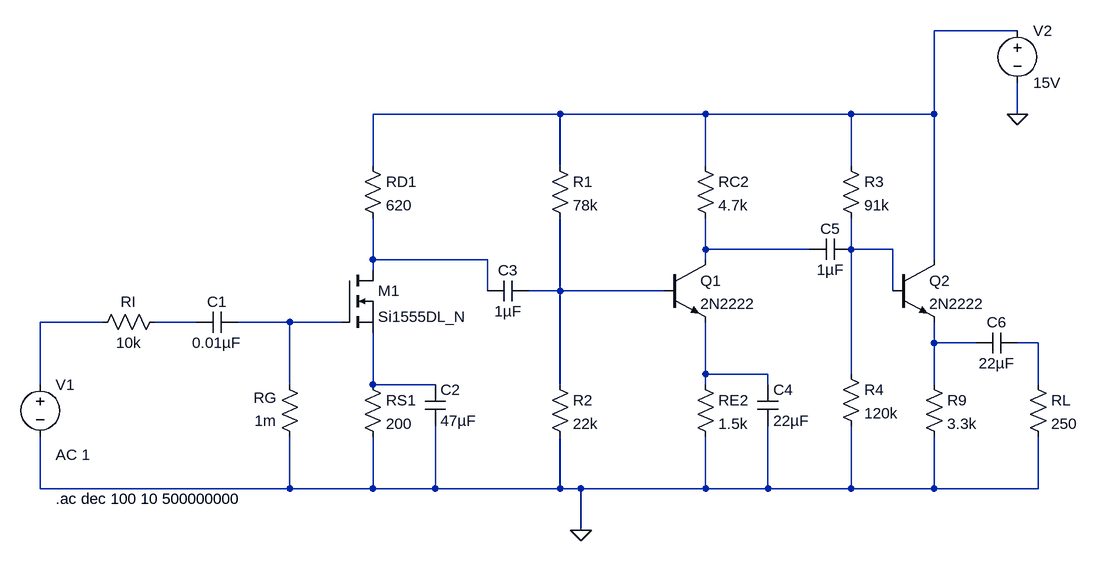
[diagram p0: schematic 3StageAmp.asc]
3StageAmp.asc, the LTspice schematic file:
Version 4
SHEET 1 880 680
WIRE 736 -160 608 -160
WIRE 32 -32 -256 -32
WIRE 256 -32 32 -32
WIRE 480 -32 256 -32
WIRE 608 -32 608 -160
WIRE 608 -32 480 -32
WIRE 736 -32 736 -80
WIRE -256 48 -256 -32
WIRE 32 48 32 -32
WIRE 256 48 256 -32
WIRE 480 48 480 -32
WIRE 256 176 256 128
WIRE 416 176 256 176
WIRE 480 176 480 128
WIRE 480 176 464 176
WIRE 544 176 480 176
WIRE -256 192 -256 128
WIRE -80 192 -256 192
WIRE 256 192 256 176
WIRE 608 192 608 -32
WIRE -256 208 -256 192
WIRE -80 240 -80 192
WIRE 32 240 32 128
WIRE 32 240 -16 240
WIRE 192 240 32 240
WIRE 544 240 544 176
WIRE -672 288 -768 288
WIRE -528 288 -592 288
WIRE -384 288 -464 288
WIRE -304 288 -384 288
WIRE 608 320 608 288
WIRE 672 320 608 320
WIRE 768 320 736 320
WIRE 256 368 256 288
WIRE 352 368 256 368
WIRE 480 368 480 176
WIRE -768 384 -768 288
WIRE -384 384 -384 288
WIRE -256 384 -256 304
WIRE -160 384 -256 384
WIRE 32 384 32 240
WIRE 256 384 256 368
WIRE 352 384 352 368
WIRE 608 384 608 320
WIRE 768 384 768 320
WIRE -768 544 -768 464
WIRE -384 544 -384 464
WIRE -384 544 -768 544
WIRE -256 544 -256 464
WIRE -256 544 -384 544
WIRE -160 544 -160 448
WIRE -160 544 -256 544
WIRE 32 544 32 464
WIRE 32 544 -160 544
WIRE 64 544 32 544
WIRE 256 544 256 464
WIRE 256 544 64 544
WIRE 352 544 352 448
WIRE 352 544 256 544
WIRE 480 544 480 448
WIRE 480 544 352 544
WIRE 608 544 608 464
WIRE 608 544 480 544
WIRE 768 544 768 464
WIRE 768 544 608 544
WIRE 64 608 64 544
FLAG 736 -32 0
FLAG 64 608 0
SYMBOL voltage -768 368 R0
WINDOW 123 24 124 Left 2
WINDOW 39 0 0 Left 0
SYMATTR InstName V1
SYMATTR Value ""
SYMATTR Value2 AC 1
SYMBOL res -576 272 R90
WINDOW 0 0 56 VBottom 2
WINDOW 3 32 56 VTop 2
SYMATTR InstName RI
SYMATTR Value 10k
SYMBOL res -368 480 R180
WINDOW 0 36 76 Left 2
WINDOW 3 36 40 Left 2
SYMATTR InstName RG
SYMATTR Value 1m
SYMBOL cap -464 272 R90
WINDOW 0 0 32 VBottom 2
WINDOW 3 32 32 VTop 2
SYMATTR InstName C1
SYMATTR Value 0.01µF
SYMBOL nmos -304 208 R0
SYMATTR InstName M1
SYMATTR Value Si1555DL_N
SYMBOL res -272 368 R0
SYMATTR InstName RS1
SYMATTR Value 200
SYMBOL cap -176 384 R0
SYMATTR InstName C2
SYMATTR Value 47µF
SYMBOL res -272 32 R0
SYMATTR InstName RD1
SYMATTR Value 620
SYMBOL res 16 32 R0
SYMATTR InstName R1
SYMATTR Value 78k
SYMBOL res 240 32 R0
SYMATTR InstName RC2
SYMATTR Value 4.7k
SYMBOL res 464 32 R0
SYMATTR InstName R3
SYMATTR Value 91k
SYMBOL cap -16 224 R90
WINDOW 0 0 32 VBottom 2
WINDOW 3 32 32 VTop 2
SYMATTR InstName C3
SYMATTR Value 1µF
SYMBOL npn 192 192 R0
SYMATTR InstName Q1
SYMATTR Value 2N2222
SYMBOL res 240 368 R0
SYMATTR InstName RE2
SYMATTR Value 1.5k
SYMBOL cap 336 384 R0
SYMATTR InstName C4
SYMATTR Value 22µF
SYMBOL cap 480 160 R90
WINDOW 0 0 32 VBottom 2
WINDOW 3 32 32 VTop 2
SYMATTR InstName C5
SYMATTR Value 1µF
SYMBOL npn 544 192 R0
SYMATTR InstName Q2
SYMATTR Value 2N2222
SYMBOL res 592 368 R0
SYMATTR InstName R9
SYMATTR Value 3.3k
SYMBOL cap 736 304 R90
WINDOW 0 0 32 VBottom 2
WINDOW 3 32 32 VTop 2
SYMATTR InstName C6
SYMATTR Value 22µF
SYMBOL res 752 368 R0
SYMATTR InstName RL
SYMATTR Value 250
SYMBOL voltage 736 -176 R0
WINDOW 123 0 0 Left 0
WINDOW 39 0 0 Left 0
SYMATTR InstName V2
SYMATTR Value 15V
SYMBOL res 16 368 R0
SYMATTR InstName R2
SYMATTR Value 22k
SYMBOL res 464 352 R0
SYMATTR InstName R4
SYMATTR Value 120k
TEXT -744 560 Left 2 !.ac dec 100 10 500000000

The netlist it stands for:
* 3StageAmp.asc
V1 N006 0 AC 1
RI N007 N006 10k
RG 0 N008 1m
C1 N008 N007 0.01µF
M1 N004 N008 N012 N012 Si1555DL_N
RS1 N012 0 200
C2 N012 0 47µF
RD1 N001 N004 620
R1 N001 N005 78k
RC2 N001 N002 4.7k
R3 N001 N003 91k
C3 N005 N004 1µF
Q1 N002 N005 N011 0 2N2222
RE2 N011 0 1.5k
C4 N011 0 22µF
C5 N003 N002 1µF
Q2 N001 N003 N009 0 2N2222
R9 N009 0 3.3k
C6 N010 N009 22µF
RL N010 0 250
V2 N001 0 15V
R2 N005 0 22k
R4 N003 0 120k
.model NPN NPN
.model PNP PNP
.lib standard.bjt
.model NMOS NMOS
.model PMOS PMOS
.lib standard.mos
.ac dec 100 10 500000000
.backanno
.end